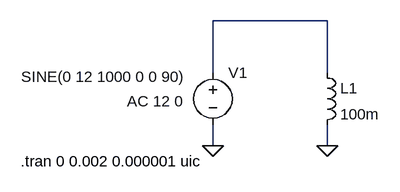
[diagram p0: schematic VoltSecondSim2.asc]
VoltSecondSim2.asc, the LTspice schematic file:
Version 4
SHEET 1 880 680
WIRE 64 48 -112 48
WIRE -112 128 -112 48
WIRE 64 128 64 48
WIRE -112 240 -112 208
WIRE 64 240 64 208
FLAG -112 240 0
FLAG 64 240 0
SYMBOL ind 48 112 R0
SYMATTR InstName L1
SYMATTR Value 100m
SYMATTR SpiceLine Cpar=0
SYMBOL voltage -112 112 R0
WINDOW 3 -295 22 Left 2
WINDOW 123 -132 60 Left 2
WINDOW 39 0 0 Left 0
SYMATTR InstName V1
SYMATTR Value SINE(0 12 1000 0 0 90)
SYMATTR Value2 AC 12 0
TEXT -408 264 Left 2 !.tran 0 0.002 0.000001 uic

The netlist it stands for:
* VoltSecondSim2.asc
L1 N001 0 100m Cpar=0
V1 N001 0 SINE(0 12 1000 0 0 90) AC 12 0
.tran 0 0.002 0.000001 uic
.backanno
.end